# Altium schematic sheet Pressure.SchDoc
size A4; SheetNumber: 5; SheetTotal: 5
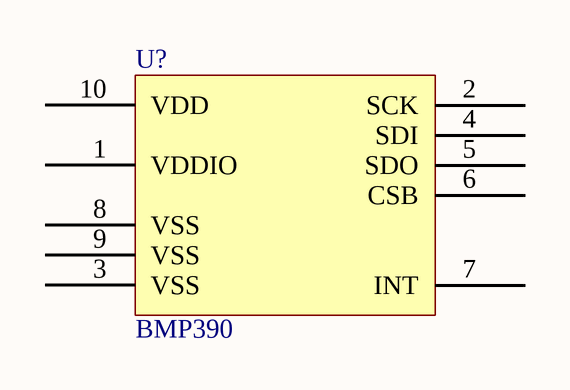
[diagram p0: Pressure.SchDoc]

## Parts
U?  BMP390  [MergenElektronik_Sensors_PressureSensors_10-WFLGA]

## Nets

Not connected (* = marked no-connect by the designer): U? 1(VDDIO) 2(SCK) 3(VSS) 4(SDI) 5(SDO) 6(CSB) 7(INT) 8(VSS) 9(VSS) 10(VDD)

## Notes on the sheet
- Title:
- Size:
- Date:
- A4
- Number:
- Time:
- Revision:
- Sheet
- of
- Project
- Drawn By :

## Library data of the parts
U? = MergenElektronik_Sensors_PressureSensors_BMP390: Mergen Elektronik - Sensors - Pressure Sensors - BMP390; Manufacturer: Bosch Sensortec; Operating Pressure: 4.35PSI ~ 18.13PSI (30kPa ~ 125kPa); Operrating Supply Voltage: 1.65V up to 3.6V; Output Type: I2C, SPI; Tolerance: ±0.01PSI (0.05kPa); Digi-Key Number: 828-BMP390TR-ND; Model: Pressure Sensor; Manufacturer Number: BMP390; Mounting Type: Surface Mount; Mouser Number: 262-BMP390; Package: 10-WFLGA; Value: BMP390; Özdisan Number: BMP390; Temperature: -40°C up to 85°C (TA); Supplier 1: Digikey; Supplier Number 1: 828-BMP390TR-ND; Supplier 2: Mouser; Supplier Number 2: 262-BMP390